# Altium schematic sheet SensorSheet.SchDoc
size A; SheetNumber: 3; SheetTotal: 4
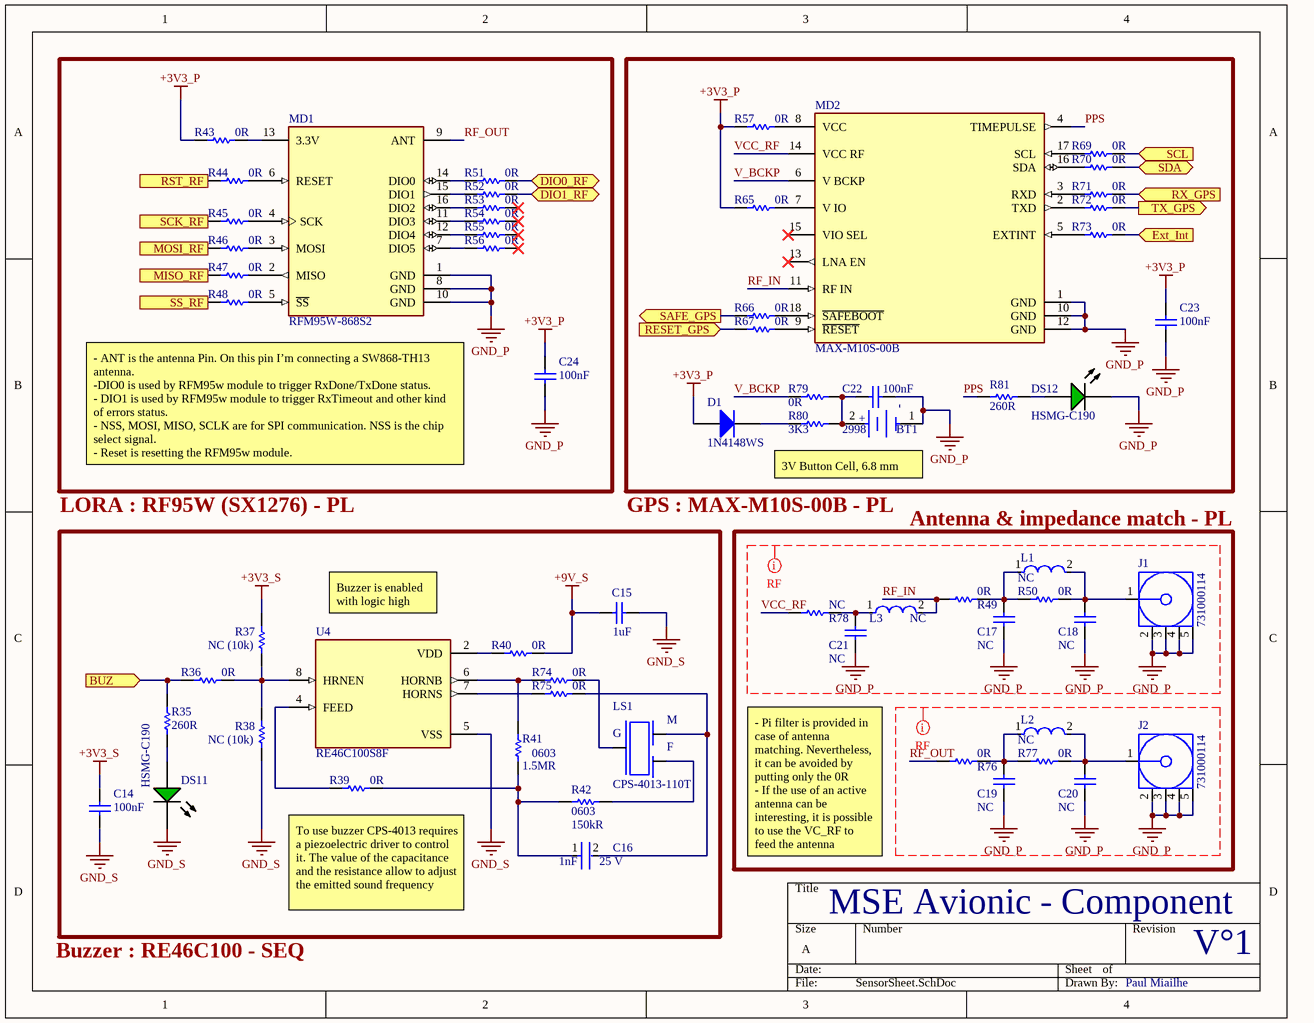
[diagram p0: SensorSheet.SchDoc]

## Parts
BT1  2998  [FP-2998-MFG]
C14  Capacitance: 100nF  [CAPC2013X135X45ML10T25]  (hidden comment: GRM21BR71H104KA01L)
C15  Capacitance: 1uF  [CAPC1608X90X35LL10T15]  (hidden comment: GRM188R61E105KA12D)
C16  Capacitance: 1nF  Voltage Rating: 25 V  [FP-C0603C-CF-MFG]  (hidden comment: C0603C102J3GACTU)
C17  Capacitance: NC  [CAPC2013X135X45ML10T25]  (hidden comment: GRM21BR71H104KA01L)
C18  Capacitance: NC  [CAPC2013X135X45ML10T25]  (hidden comment: GRM21BR71H104KA01L)
C19  Capacitance: NC  [CAPC2013X135X45ML10T25]  (hidden comment: GRM21BR71H104KA01L)
C20  Capacitance: NC  [CAPC2013X135X45ML10T25]  (hidden comment: GRM21BR71H104KA01L)
C21  Capacitance: NC  [CAPC2013X135X45ML10T25]  (hidden comment: GRM21BR71H104KA01L)
C22  Capacitance: 100nF  [CAPC2013X135X45ML10T25]  (hidden comment: GRM21BR71H104KA01L)
C23  Capacitance: 100nF  [CAPC2013X135X45ML10T25]  (hidden comment: GRM21BR71H104KA01L)
C24  Capacitance: 100nF  [CAPC2013X135X45ML10T25]  (hidden comment: GRM21BR71H104KA01L)
D1  1N4148WS  [FAIR-SOD-323_V]
DS11  HSMG-C190  [AVAG-HSMX-C190_V]
DS12  HSMG-C190  [AVAG-HSMX-C190_V]
J1  731000114  [MOLX-731000114_V]
J2  731000114  [MOLX-731000114_V]
L1  NC  [FP-B82422A-MFG]
L2  NC  [FP-B82422A-MFG]
L3  NC  [FP-B82422A-MFG]
LS1  CPS-4013-110T  [XDCR_CPS-4013-110T]
MD1  RFM95W-868S2  [FP-RFM95W-868S2-MFG]
MD2  MAX-M10S-00B  [FP-MAX-M10S-00B-MFG]
R35  260R  [RESC1609X50X30NL8T20]  (no BOM)
R36  0R  [RESC1608X55X25ML10T15]
R37  Resistance: NC (10k)  [RESC1609X55X30LL15T15]  (hidden comment: ERJ3EKF1002V)
R38  Resistance: NC (10k)  [RESC1609X55X30LL15T15]  (hidden comment: ERJ3EKF1002V)
R39  Resistance: 0R  [RESC1608X55X25ML10T15]  (hidden comment: RC0603JR-070RL)
R40  0R  [RESC1608X55X25ML10T15]
R41  Case Code (Imperial): 0603  Resistance: 1.5MR  [RESC1608X55X30ML15T15]  (hidden comment: ERJ-3GEYJ155V)
R42  Case Code (Imperial): 0603  Resistance: 150kR  [RESC1608X55X30NL15T15]  (hidden comment: ERJ-3EKF1503V)
R43  0R  [RESC1608X55X25ML10T15]
R44  0R  [RESC1608X55X25ML10T15]
R45  0R  [RESC1608X55X25ML10T15]
R46  0R  [RESC1608X55X25ML10T15]
R47  0R  [RESC1608X55X25ML10T15]
R48  0R  [RESC1608X55X25ML10T15]
R49  0R  [RESC1608X55X25ML10T15]
R50  0R  [RESC1608X55X25ML10T15]
R51  0R  [RESC1608X55X25ML10T15]
R52  0R  [RESC1608X55X25ML10T15]
R53  0R  [RESC1608X55X25ML10T15]
R54  0R  [RESC1608X55X25ML10T15]
R55  0R  [RESC1608X55X25ML10T15]
R56  0R  [RESC1608X55X25ML10T15]
R57  0R  [RESC1608X55X25ML10T15]
R65  0R  [RESC1608X55X25ML10T15]
R66  0R  [RESC1608X55X25ML10T15]
R67  0R  [RESC1608X55X25ML10T15]
R69  0R  [RESC1608X55X25ML10T15]
R70  0R  [RESC1608X55X25ML10T15]
R71  0R  [RESC1608X55X25ML10T15]
R72  0R  [RESC1608X55X25ML10T15]
R73  0R  [RESC1608X55X25ML10T15]
R74  0R  [RESC1608X55X25ML10T15]
R75  0R  [RESC1608X55X25ML10T15]
R76  0R  [RESC1608X55X25ML10T15]
R77  0R  [RESC1608X55X25ML10T15]
R78  NC  [RESC1608X55X25ML10T15]
R79  0R  [RESC1608X55X25ML10T15]
R80  Resistance: 3K3  [RESC1608X55X25ML10T15]  (hidden comment: RC0603FR-073K3L)
R81  260R  [RESC1609X50X30NL8T20]  (no BOM)
U4  RE46C100S8F  [SOIC127P600X175-8N]

## Blocks framed on the sheet
Antenna & impedance match - PL: C17-C21 J1 J2 L1-L3 R49 R50 R76-R78

## Ports
BUZ (in), DIO0_RF (bidir), DIO1_RF (bidir), Ext_Int (in), MISO_RF (out), MOSI_RF (in), RESET_GPS (in), RST_RF (in), RX_GPS (in), SAFE_GPS (out), SCK_RF (in), SCL (in), SDA (bidir), SS_RF (in), TX_GPS (out)

## Nets
+3V3_P: C23.2 C24.2 D1.1(A) R43.1 R57.1 R65.1
+3V3_S: C14.2 R37.2
+9V_S: C15.1 R40.2
GND_P: BT1.1(C) C17.1 C18.1 C19.1 C20.1 C21.1 C22.1 C23.1 C24.1 DS12.2(K) J1.2 J1.3 J1.4 J1.5 J2.2 J2.3 J2.4 J2.5 MD1.1(GND) MD1.8(GND) MD1.10(GND) MD2.1(GND) MD2.10(GND) MD2.12(GND)
GND_S: C14.1 C15.2 DS11.2(K) R38.1 U4.5(VSS)
BUZ: R35.1 R36.1 ; port BUZ
DIO0_RF: R51.2 ; port DIO0_RF
DIO1_RF: R52.2 ; port DIO1_RF
Ext_Int: R73.2 ; port Ext_Int
MISO_RF: R47.1 ; port MISO_RF
MOSI_RF: R46.1 ; port MOSI_RF
PPS: MD2.4(TIMEPULSE) R81.1
RESET_GPS: R67.1 ; port RESET_GPS
RF_IN: L3.2 MD2.11(RF_IN) R49.1
RF_OUT: MD1.9(ANT) R76.1
RST_RF: R44.1 ; port RST_RF
RX_GPS: R71.2 ; port RX_GPS
SAFE_GPS: R66.1 ; port SAFE_GPS
SCK_RF: R45.1 ; port SCK_RF
SCL: R69.2 ; port SCL
SDA: R70.2 ; port SDA
SS_RF: R48.1 ; port SS_RF
TX_GPS: R72.2 ; port TX_GPS
V_BCKP: MD2.6(V_BCKP) R79.1
VCC_RF: MD2.14(VCC_RF) R78.1
NetBT1_2: BT1.2(A) C22.2 R79.2 R80.1
NetC16_1: C16.1 R39.2 R41.1 R42.1
NetC16_2: C16.2 LS1.1(M) R75.2
NetC17_2: C17.2 L1.1 R49.2 R50.1
NetC18_2: C18.2 J1.1 L1.2 R50.2
NetC19_2: C19.2 L2.1 R76.2 R77.1
NetC20_2: C20.2 J2.1 L2.2 R77.2
NetC21_2: C21.2 L3.1 R78.2
NetD1_2: D1.2(K) R80.2
NetDS11_1: DS11.1(A) R35.2
NetDS12_1: DS12.1(A) R81.2
NetLS1_2: LS1.2(F) R42.2
NetLS1_3: LS1.3(G) R74.1
NetMD1_2: MD1.2(MISO) R47.2
NetMD1_3: MD1.3(MOSI) R46.2
NetMD1_4: MD1.4(SCK) R45.2
NetMD1_5: MD1.5(~{SS}) R48.2
NetMD1_6: MD1.6(RESET) R44.2
NetMD1_7: MD1.7(DIO5) R56.1
NetMD1_11: MD1.11(DIO3) R54.1
NetMD1_12: MD1.12(DIO4) R55.1
NetMD1_13: MD1.13(3.3V) R43.2
NetMD1_14: MD1.14(DIO0) R51.1
NetMD1_15: MD1.15(DIO1) R52.1
NetMD1_16: MD1.16(DIO2) R53.1
NetMD2_2: MD2.2(TXD) R72.1
NetMD2_3: MD2.3(RXD) R71.1
NetMD2_5: MD2.5(EXTINT) R73.1
NetMD2_7: MD2.7(V_IO) R65.2
NetMD2_8: MD2.8(VCC) R57.2
NetMD2_9: MD2.9(~{RESET}) R67.2
NetMD2_16: MD2.16(SDA) R70.1
NetMD2_17: MD2.17(SCL) R69.1
NetMD2_18: MD2.18(~{SAFEBOOT}) R66.2
NetR36_2: R36.2 R37.1 R38.2 U4.8(HRNEN)
NetR39_1: R39.1 U4.4(FEED)
NetR40_1: R40.1 U4.2(VDD)
NetR41_2: R41.2 R74.2 U4.6(HORNB)
NetR75_1: R75.1 U4.7(HORNS)

Not connected (* = marked no-connect by the designer): MD2 13(LNA_EN)* 15(VIO_SEL)*; R53 2*; R54 2*; R55 2*; R56 2*

## Layout directives
net class 50R; rule Width Constraint [Pref Impedance = 50,00ohms    Min Impedance = 50,00ohms    Max Impedance = 50,00ohms]: GND_P, RF_IN, RF_OUT, VCC_RF

## Notes on the sheet
- - ANT is the antenna Pin. On this pin I’m connecting a SW868-TH13 antenna.
  -DIO0 is used by RFM95w module to trigger RxDone/TxDone status.
  - DIO1 is used by RFM95w module to trigger RxTimeout and other kind of errors status.
  - NSS, MOSI, MISO, SCLK are for SPI communication. NSS is the chip select signal.
  - Reset is resetting the RFM95w module.
- LORA : RF95W (SX1276) - PL
- GPS : MAX-M10S-00B - PL
- 3V Button Cell, 6.8 mm
- (near U4) Buzzer is enabled with logic high
- (near R39) To use buzzer CPS-4013 requires a piezoelectric driver to control it. The value of the capacitance and the resistance allow to adjust the emitted sound frequency
- - Pi filter is provided in case of antenna matching. Nevertheless, it can be avoided by putting only the 0R
  - If the use of an active antenna can be interesting, it is possible to use the VC_RF to feed the antenna
- Buzzer : RE46C100 - SEQ
- MSE Avionic - Component
- V°1
- Paul Miailhe
- (in symbol CMP-19636-000010-1) -; +

## Library data of the parts
BT1 = CMP-19636-000010-1: BATTERY RETAINER COIN 6.8MM SMD; Number of Batteries: 1; Package Quantity: 100; Mount: Surface Mount; Case/Package: SMD/SMT; Number of Cells: 1; REACH SVHC: No SVHC; Height: 2.9mm; Contact Material: Bronze; Material: Bronze; Lead Free: Lead Free; Termination: SMD/SMT; Color: Silver
C14 C17-C24 = CMP-2100-03644-1: Chip Capacitor, 0.1 uF, +/- 10%, 50 V, -55 to 125 degC, 0805 (2012 Metric), RoHS, Tape and Reel; Manufacturer: Murata; Voltage: 50V; Insulation Resistance: 10GR; Dielectric Material: Ceramic; Dielectric: X7R; Package Description: 2-Pin Surface Mount Device, Body 2 x 1.25 mm; Manufacturer URL: http://www.murata.com/; Case Code (Imperial): 0805; Datasheet URL: http://psearch.en.murata.com/capacitor/product/GRM21BR71H104KA01%23.pdf; Termination: SMD/SMT; Lead Free: LeadFree; Package Quantity: 1; Mount: SurfaceMount; REACH SVHC: Unknown; Thickness: 0.053inch; Height: 1.25mm; Case/Package: 0805; Voltage Rating: 50V; Width: 0.049inch; Case Code (Metric): 2012; Material: Ceramic; Min Operating Temperature: -55degC; RoHSCompliant: true; Datasheet Version: 42675.0; Voltage Rating (DC): 50V; Tolerance: 10%; Package Reference: 0805; Depth: 1.25mm; Length: 2mm; Max Operating Temperature: 125degC; Packaging: TapeandReel; Number of Pins: 2; Radiation Hardening: No
C15 = CMP-2006-02459-1: Manufacturer: Murata; Material: Ceramic; Tolerance: 10%; Voltage Rating: 25V; Dielectric: X5R; Part Number: GRM188R61E105KA12D; Supplier 1: Farnell; Supplier Part Number 1: 1828802; Manufacturer Part Number: GRM188R61E105KA12D; RoHS: Yes; Category: Ceramic Capacitors; Pricing 1: 10=0.13400, 100=0.05920, 500=0.03800, 1000=0.03090 (GBP); Mount: Surface Mount; Case/Package: 0603; Number of Pins: 2; Case Code (Metric): 1608; Case Code (Imperial): 0603; Min Operating Temperature: -55°C; Max Operating Temperature: 85°C; Packaging: Tape and Reel; Package Quantity: 4000; Voltage Rating (DC): 25V; Termination: SMD/SMT; Voltage: 25V; Length: 1.6mm; Width: 0.031inch; Height: 0.8mm; Depth: 0.8mm; Thickness: 0.035inch; Radiation Hardening: No; RoHS Compliant: Yes; REACH SVHC: No SVHC; Lead Free: Lead Free
C16 = CMP-2006-03010-2: CAP CER 1000PF 25V 5% NP0 0603; Manufacturer: KEMET; Value: 1,000 pF; Tolerance: 0.05; Temperature Characteristic: C0G; Temperature Coefficient: 30ppm/°C; Automotive Grade: Grade 1; Material: Ceramic; Category: Cap; Device Class L2: Capacitors; Octopart: https://octopart.com/c0603c102j3gactu-kemet-8375722; ComponentLink2URL: https://api.kemet.com/component-edge/download/datasheet/C0603C100J5GACAUTO.pdf; Digikey Description: CAP CER 1000PF 25V 5% NP0 0603; Device Class L3: Ceramic Capacitors; Temperature Range Low: -55°C; Automotive: Yes; RoHS: TRUE; Temperature Range High: +125°C; ComponentLink2Description: Datasheet; Mouser Description: Multilayer Ceramic Capacitors MLCC - SMD/SMT 25volts 1000pF C0G 5%; Lead Free: Yes; Height: 0.87mm; Temperature: -55°C to +125°C; Manufacturer Part Number: C0603C102J3GACTU; Device Class L1: Passive Components; Package: C0603C-CF; Supplier 1: Mouser; Supplier Part Number 1: 80-C0603C102J3G; Stock 1: 70048; Pricing 1: 1=0,10000, 10=0,02700, 50=0,02700, 100=0,02200, 500=0,01600, 1000=0,01200, 4000=0,01000, 8000=0,00900, 10000=0,00900 (USD); Mount: Surface Mount; Case/Package: 0603; Number of Pins: 2; Case Code (Imperial): 0603; Case Code (Metric): 1608; Dielectric Material: Ceramic; Contact Plating: Tin,Matte; Min Operating Temperature: -55°C; Max Operating Temperature: 125°C; Packaging: Tape and Reel; Package Quantity: 1; Voltage Rating (DC): 25V; Dielectric: C0G; Termination: SMD/SMT; Series: C; Construction: Flat; Voltage: 25V; Length: 1.6mm; Width: 0.031inch; Thickness: 0.034inch; Depth: 0.8mm; Lead Pitch: 0.7mm; Radiation Hardening: No; RoHS Compliant: Yes; REACH SVHC: No SVHC; ComponentLink1URL: https://datasheet.ciiva.com/18192/getdatasheetpartid-127803-18192629.pdf?src-supplier=Verical; ComponentLink1Description: https://datasheet.ciiva.com/18192/getdatasheetpartid-127803-18192629.pdf?src-supplier=Verical; ComponentLink3URL: https://datasheet.ciiva.com/7823/f9080b-0402-series-c0g-7823966.pdf?src-supplier=Element14; ComponentLink3Description: https://datasheet.ciiva.com/7823/f9080b-0402-series-c0g-7823966.pdf?src-supplier=Element14; ComponentLink4URL: https://datasheet.ciiva.com/7823/f9080b-0402-series-c0g-7823967.pdf?src-supplier=Element14; ComponentLink4Description: https://datasheet.ciiva.com/7823/f9080b-0402-series-c0g-7823967.pdf?src-supplier=Element14
D1 = CMP-004-00001-2: Small Signal Diode, 75 V, 0.15 A, -55 to 150 degC, 2-Pin SOD-323, RoHS, Tape and Reel; Manufacturer: Fairchild; Recovery Time: 4ns; Forward Voltage: 1V; Peak Reverse Current: 5uA; Forward Current: 150mA; Capacitance: -323f; Datasheet URL: https://www.fairchildsemi.com/datasheets/1N/1N4148WS.pdf; Package Reference: SOD-323; Package Description: 2-Pin Small Outline Diode Flat Lead, Body 1.7 x 1.25 mm; Case/Package: SOD-323; Mounting Technology: SM; Manufacturer URL: https://www.fairchildsemi.com/; Pins: 2; Packaging: TapeandReel; Package Quantity: 3000; Min Operating Temperature: -55°C; RoHS Compliant: True; Max Operating Temperature: 150°C; Datasheet Version: Rev. 1.2, 03/2015
DS11 DS12 = CMP-1744-00002-1: Chip LED, Green, 2.2 V, -40 to 85 degC, 2-Pin SMD, RoHS, Tape and Reel; Frequency: 400 KHz; Max Supply Voltage: 5.5 V; Access Time: 3500 ns; Clock Frequency: 100 KHz; Case\Package: SOIC; Density: 32 kb; Nominal Supply Current: 2 mA; Interface: Serial; Min Supply Voltage: 1.7 V; Packaging: Tape and Reel; PackageReference: HSMX-C190; ComponentLink2URL: http://docs.avagotech.com/docs/AV02-0551EN; RoHSCompliant: true; Pins: 8; REACH SVHC: No SVHC; Max Operating Temperature: 85 degC; Width: 4 mm; Radiation Hardening: No; Package Quantity: 3000; ComponentLink3Description: Package Specification; ComponentLink1Description: Manufacturer URL; Min Operating Temperature: -40 degC; PackageDescription: 2-Pin Surface Mount Device, Body 1.6 x 0.8 mm, Height 0.9 mm; Max Clock Frequency: 100 KHz; Height: 1.5 mm; ComponentLink1URL: http://www.avagotech.com/; DatasheetVersion: Mar-12; ComponentLink2Description: Datasheet; Mount: Surface Mount; Length: 5 mm; ComponentLink3URL: http://www.fairchildsemi.com/dwg/MA/MA03D.pdf
J1 J2 = CMP-2000-05487-1: SMA Right-Angle PCB Jack Receptacle, Brass Body, Gold Plated, 50 Ohm, 5-Pin THD, RoHS, Tray; Manufacturer: Molex; Datasheet Version: 09/2016; Package Description: 5-Pin Through Hole Device, Body 14.8 x 6.35 mm, Pitch 2.54 mm; Datasheet URL: http://www.molex.com/webdocs/datasheets/pdf/en-us/0731000114_RF_COAX_CONNECTORS.pdf; Manufacturer URL: http://www.molex.com/; Package Reference: 731000114; Mounting Technology: ThroughHole; Package URL: http://www.molex.com/pdm_docs/sd/731000114_sd.pdf
L1-L3 = CMP-2000-05912-2: FIXED IND 10UH 180MA 1.6 OHM SMD; Tolerance: 10%; Core Material: Ferrite; Q Factor: 27; Self Resonant Frequency: 25MHz; Shielding: Unshielded; Test Frequency: 1MHz; Series Resistance: 1.6R; Radiation Hardening: No; REACH SVHC: No SVHC; Width: 0.098inch; RoHS Compliant: Yes; Case/Package: 1210; DC Current: 180mA; Package Quantity: 2000; Height - Seated (Max): 0.083inch; Rated Current-Max: 180mA; Series: SIMID; Mount: Surface Mount; Depth: 2.8mm; Resistor Type: Wirewound; Max DC Current: 180mA; Termination: SMD/SMT; Contact Plating: Tin; Height: 2.1mm; Inductance: 10uH; Case Code (Metric): 3225; Lead Free: Lead Free; Weight: 0.001764oz; Max Operating Temperature: 125°C; Length: 3.5mm; Packaging: Tape and Reel; Case Code (Imperial): 1210; Inductance Tolerance: 10%; Ratings: AEC-Q200; Number of Pins: 2; Current Rating: 180mA; Military Standard: Not; DC Resistance (DCR): 1.6R
LS1 = CMP-003-000000-2: 40 mm, 9 Vdc, 110 dB, Through Hole, Piezo Audio Transducer Buzzer; MF: CUI Devices; Component Type: Standard; Design Item ID: CPS-4013-110T; Package: None; CUI_purchase_URL: https://www.cuidevices.com/product/audio/buzzers/audio-transducers/cps-4013-110t?utm_source=snapeda.com&utm_medium=referral&utm_campaign=snapedaBOM; Availability: In Stock; Value: *; Source: CPS-4013-110T.SchLib; Check_prices: https://www.snapeda.com/parts/CPS-4013-110T/CUI+Devices/view-part/?ref=eda; MP: CPS-4013-110T; Purchase-URL: https://pricing.snapeda.com/search/part/CPS-4013-110T/?ref=eda; Pin Count: 3; Price: None; SnapEDA_Link: https://www.snapeda.com/parts/CPS-4013-110T/CUI+Devices/view-part/?ref=snap
MD1 = CMP-204316-000001-1: RX TXRX MODULE ISM < 1GHZ SMD; Data Rate: 300Kbps; Frequency: 868MHz; Sensitivity: -123dBm; Interface: SPI; Current - Transmitting: 120mA; Current - Receiving: 12.1mA; Max Operating Temperature: 70°C; Case/Package: SMD/SMT; Packaging: Bulk; Mount: Surface Mount; Min Operating Temperature: -20°C
MD2 = CMP-207130-000026-1: GNSS LCC RX, ROM, TCXO, LNA, SAW
R35 R81 = CMP-2000-03816-5: Manufacturer: Vishay Semiconductor; Voltage Rating: 75 V; Package Quantity: 5000; DatasheetVersion: 06/2012; Min Operating Temperature: -55 degC; ComponentLink1URL: http://www.vishay.com/; Mounting Technology: Surface Mount; Height: 0.45 mm; ComponentLink1Description: Manufacturer URL; REACH SVHC: Unknown; PackageReference: 0603; Packaging: Tape and Reel; Max Operating Temperature: 155 degC; Mount: Surface Mount; ComponentLink2Description: Datasheet; PackageDescription: 2-Pin Surface Mount Device, Body 1.575 x 0.85 mm; Length: 1.55 mm; ComponentLink2URL: http://www.vishay.com/docs/20035/dcrcwe3.pdf; Pins: 2; RoHSCompliant: true
R36 R40 R43-R57 R65-R67 R69-R79 = CMP-2100-03667-1: Chip Resistor, 0 Ohm, +/- 5%, 0.1 W, -55 to 155 degC, 0603 (1608 Metric), RoHS, Tape and Reel; Manufacturer: Yageo; Temperature Coefficient: 200ppm/degreesC; Voltage Rating: 50V; Power Rating: 100mW; Resistance: 0mOhm; Width: 0.8mm; Max Operating Temperature: 155degC; Tolerance: 5%; Package Reference: 0603; Height: 0.45mm; Depth: 0.8mm; Package Description: 2-Pin Surface Mount Device, Body 1.6 x 0.8 mm; Termination: SMD/SMT; Package Quantity: 5000; Case/Package: 0603; Case Code (Imperial): 0603; Radiation Hardening: No; Number of Pins: 2; Length: 1.6mm; Lead Free: LeadFree; Voltage Rating (DC): 50V; Military Standard: Not; Datasheet URL: http://www.yageo.com/NewPortal/yageodocoutput?fileName=/pdf/R-Chip/PYu-RC_Group_51_RoHS_L_5.pdf; Manufacturer URL: http://www.yageo.com/; Packaging: TapeandReel; Case Code (Metric): 1608; Min Operating Temperature: -55degC; Composition: ThickFilm; RoHSCompliant: true; Contact Plating: Tin; Datasheet Version: Rev. 5, 10/2016; REACH SVHC: NoSVHC
R37 R38 = CMP-1012-00623-3: Chip Resistor, 10 KOhm, +/- 1%, 0.1 W, -55 to 155 degC, 0603 (1608 Metric), RoHS, Tape and Reel; Manufacturer: Panasonic; Manufacturer Part Number: ERJ-3EKF1002V; Voltage Rating: 75V; Case\/Package: 0603; Power Rating: 100mW; Temperature Coefficient: 100ppm\/degreesC; Number of Pins: 2; Package Reference: 603; Depth: 0.8mm; Mount: SurfaceMount; Package Description: 2-Pin Surface Mount Device, Body 1.6 x 0.85 mm; Datasheet Version: 02/2017; Length: 1.6mm; Lead Free: LeadFree; Height: 0.45mm; Number of Terminations: 2; Max Power Dissipation: 100mW; Min Operating Temperature: -55degC; Datasheet URL: https://industrial.panasonic.com/cdbs/www-data/pdf/RDA0000/AOA0000C304.pdf; Termination: SMD/SMT; Case Code (Metric): 1608; Tolerance: 1%; Max Operating Temperature: 155degC; RoHSCompliant: true; Voltage Rating (DC): 75V; Radiation Hardening: No; Packaging: TapeandReel; Composition: ThickFilm; Mounting Technology: SurfaceMount; Manufacturer URL: http://www.panasonic.com/; Width: 0.031inch; REACH SVHC: NoSVHC; Contact Plating: Tin; Military Standard: Not; Package Quantity: 1; Supplier 1: Mouser; Supplier Part Number 1: 667-ERJ-3EKF1002V; RoHS: Yes; Category: Chip SMD Resistors; Stock 1: 20455; Pricing 1: 1=0,10000, 10=0,04000, 50=0,04000, 100=0,01700, 1000=0,00700, 5000=0,00500, 10000=0,00500 (USD); Case/Package: 0603; Size Code: 0603; Resistor Type: Thick Film; Series: ERJ; Resistance Tolerance: 1%; Construction: Rectangular; Features: Automotive AEC-Q200; Technology: THICK FILM; RoHS Compliant: Yes; ComponentLink1URL: https://datasheet.ciiva.com/16511/aoa0000ce2-16511861.pdf?src-supplier=Avnet+Asia; ComponentLink1Description: https://datasheet.ciiva.com/16511/aoa0000ce2-16511861.pdf?src-supplier=Avnet+Asia; ComponentLink2URL: https://datasheet.ciiva.com/46372/1678782-46372725.pdf?src-supplier=Element14; ComponentLink2Description: https://datasheet.ciiva.com/46372/1678782-46372725.pdf?src-supplier=Element14; ComponentLink3URL: https://datasheet.ciiva.com/28514/426256-28514198.pdf?src-supplier=Element14; ComponentLink3Description: https://datasheet.ciiva.com/28514/426256-28514198.pdf?src-supplier=Element14; ComponentLink4URL: https://datasheet.ciiva.com/9194/aoa0000ce2-9194199.pdf?src-supplier=Avnet; ComponentLink4Description: https://datasheet.ciiva.com/9194/aoa0000ce2-9194199.pdf?src-supplier=Avnet; ComponentLink5URL: https://datasheet.ciiva.com/7830/aoa0000ce2-7830729.pdf?src-supplier=Element14; ComponentLink5Description: https://datasheet.ciiva.com/7830/aoa0000ce2-7830729.pdf?src-supplier=Element14; ComponentLink6URL: https://datasheet.ciiva.com/17212/aoa0000ce2-17212105.pdf?src-supplier=Avnet+Europe; ComponentLink6Description: https://datasheet.ciiva.com/17212/aoa0000ce2-17212105.pdf?src-supplier=Avnet+Europe; ComponentLink7URL: https://datasheet.ciiva.com/30208/aoa0000ce2-30208985.pdf?src-supplier=Onlinecomponents.com; ComponentLink7Description: https://datasheet.ciiva.com/30208/aoa0000ce2-30208985.pdf?src-supplier=Onlinecomponents.com; ComponentLink8URL: https://datasheet.ciiva.com/48530/aoa0000ce2-48530988.pdf?src-supplier=Avnet; ComponentLink8Description: https://datasheet.ciiva.com/48530/aoa0000ce2-48530988.pdf?src-supplier=Avnet; ComponentLink9URL: https://datasheet.ciiva.com/24070/aoa0000ce2-24070318.pdf?src-supplier=Mouser; ComponentLink9Description: https://datasheet.ciiva.com/24070/aoa0000ce2-24070318.pdf?src-supplier=Mouser; ComponentLink10URL: https://datasheet.ciiva.com/16759/70260748-16759807.pdf?src-supplier=Allied+Electronics; ComponentLink10Description: https://datasheet.ciiva.com/16759/70260748-16759807.pdf?src-supplier=Allied+Electronics
R39 = CMP-2100-03667-1: Chip Resistor, 0 Ohm, +/- 5%, 0.1 W, -55 to 155 degC, 0603 (1608 Metric), RoHS, Tape and Reel; Manufacturer: Yageo; Temperature Coefficient: 200ppm/degreesC; Voltage Rating: 50V; Power Rating: 100mW; Width: 0.8mm; Max Operating Temperature: 155degC; Tolerance: 5%; Package Reference: 0603; Height: 0.45mm; Depth: 0.8mm; Package Description: 2-Pin Surface Mount Device, Body 1.6 x 0.8 mm; Termination: SMD/SMT; Package Quantity: 5000; Case/Package: 0603; Case Code (Imperial): 0603; Radiation Hardening: No; Number of Pins: 2; Length: 1.6mm; Lead Free: LeadFree; Voltage Rating (DC): 50V; Military Standard: Not; Datasheet URL: http://www.yageo.com/NewPortal/yageodocoutput?fileName=/pdf/R-Chip/PYu-RC_Group_51_RoHS_L_5.pdf; Manufacturer URL: http://www.yageo.com/; Packaging: TapeandReel; Case Code (Metric): 1608; Min Operating Temperature: -55degC; Composition: ThickFilm; RoHSCompliant: true; Contact Plating: Tin; Datasheet Version: Rev. 5, 10/2016; REACH SVHC: NoSVHC
R41 = CMP-2000-00727-1: Manufacturer: Panasonic; Tolerance: 5%; Temperature Coefficient: 150ppm/°C; Max Power Dissipation: 100mW; Voltage Rating (DC): 50V; Voltage Rating: 75V; Part Number: ERJ-3GEYJ155V; Supplier 1: Mouser; Supplier Part Number 1: 667-ERJ-3GEYJ155V; Manufacturer Part Number: ERJ-3GEYJ155V; RoHS: Yes; Category: Chip SMD Resistors; Stock 1: 76730; Pricing 1: 1=0,10000, 10=0,03400, 50=0,03400, 100=0,01400, 1000=0,00700, 2500=0,00600, 5000=0,00400, 10000=0,00400 (USD); Mount: Surface Mount; Case/Package: 0603; Case Code (Metric): 1608; Contact Plating: Tin; Min Operating Temperature: -55°C; Max Operating Temperature: 155°C; Packaging: Tape and Reel; Resistor Type: Thick Film; Package Quantity: 1; Number of Terminations: 2; Features: Automotive AEC-Q200; Series: ERJ; Power Rating: 100mW; Termination: SMD/SMT; Resistance Tolerance: 5%; Construction: Rectangular; Technology: THICK FILM; Length: 1.6mm; Width: 0.031inch; Height: 0.45mm; Depth: 0.8mm; RoHS Compliant: Yes; Lead Free: Lead Free; Military Standard: Not; REACH SVHC: No SVHC; ComponentLink1URL: https://datasheet.ciiva.com/11821/0900766b80f806dd-11821430.pdf?src-supplier=RSComponents; ComponentLink1Description: https://datasheet.ciiva.com/11821/0900766b80f806dd-11821430.pdf?src-supplier=RSComponents; ComponentLink2URL: https://datasheet.ciiva.com/16780/70255313-16780680.pdf?src-supplier=Allied+Electronics; ComponentLink2Description: https://datasheet.ciiva.com/16780/70255313-16780680.pdf?src-supplier=Allied+Electronics; ComponentLink3URL: https://datasheet.ciiva.com/9198/aoa0000ce1-9198090.pdf?src-supplier=Avnet; ComponentLink3Description: https://datasheet.ciiva.com/9198/aoa0000ce1-9198090.pdf?src-supplier=Avnet; ComponentLink4URL: https://datasheet.ciiva.com/30248/4aoa0000ce1-30248779.pdf?src-supplier=Onlinecomponents.com; ComponentLink4Description: https://datasheet.ciiva.com/30248/4aoa0000ce1-30248779.pdf?src-supplier=Onlinecomponents.com; ComponentLink5URL: https://datasheet.ciiva.com/5959/1500035-5959709.pdf?src-supplier=Farnell; ComponentLink5Description: https://datasheet.ciiva.com/5959/1500035-5959709.pdf?src-supplier=Farnell; ComponentLink6URL: https://datasheet.ciiva.com/28658/1678796-28658445.pdf?src-supplier=Element14; ComponentLink6Description: https://datasheet.ciiva.com/28658/1678796-28658445.pdf?src-supplier=Element14; ComponentLink7URL: https://datasheet.ciiva.com/15828/aoa0000ce1-15828430.pdf?src-supplier=Onlinecomponents.com; ComponentLink7Description: https://datasheet.ciiva.com/15828/aoa0000ce1-15828430.pdf?src-supplier=Onlinecomponents.com
R42 = CMP-1012-00754-2: Manufacturer: Panasonic; Power Rating: 100mW; Tolerance: 1%; Voltage Rating: 75V; Temperature Coefficient: 100ppm/°C; Part Number: ERJ-3EKF1503V; Supplier 1: Mouser; Supplier Part Number 1: 667-ERJ-3EKF1503V; Manufacturer Part Number: ERJ-3EKF1503V; RoHS: Yes; Category: Chip SMD Resistors; Stock 1: 1123; Pricing 1: 1=0,10000, 10=0,03700, 50=0,03700, 100=0,01500, 1000=0,00800, 2500=0,00700, 5000=0,00600, 10000=0,00600 (USD); Mount: Surface Mount; Case/Package: 0603; Number of Pins: 2; Case Code (Metric): 1608; Contact Plating: Tin; Weight: 7.1E-05oz; Min Operating Temperature: -55°C; Max Operating Temperature: 155°C; Packaging: Tape and Reel; Package Quantity: 1; Termination: SMD/SMT; Max Power Dissipation: 100mW; Resistor Type: Thick Film; Number of Terminations: 2; Features: Automotive AEC-Q200; Series: ERJ; Resistance Tolerance: 1%; Voltage Rating (DC): 75V; Construction: Rectangular; Length: 1.6mm; Width: 0.8mm; Height: 0.022inch; Depth: 0.8mm; Radiation Hardening: No; Military Standard: Not; Lead Free: Lead Free; RoHS Compliant: Yes; REACH SVHC: No SVHC; ComponentLink1URL: https://datasheet.ciiva.com/6137/aoa0000ce2-6137485.pdf?src-supplier=Farnell; ComponentLink1Description: https://datasheet.ciiva.com/6137/aoa0000ce2-6137485.pdf?src-supplier=Farnell; ComponentLink2URL: https://datasheet.ciiva.com/7909/aoa0000ce2-7909193.pdf?src-supplier=Element14; ComponentLink2Description: https://datasheet.ciiva.com/7909/aoa0000ce2-7909193.pdf?src-supplier=Element14; ComponentLink3URL: https://datasheet.ciiva.com/7909/426256-7909546.pdf?src-supplier=Element14; ComponentLink3Description: https://datasheet.ciiva.com/7909/426256-7909546.pdf?src-supplier=Element14; ComponentLink4URL: https://datasheet.ciiva.com/22687/1678782-22687434.pdf?src-supplier=Element14; ComponentLink4Description: https://datasheet.ciiva.com/22687/1678782-22687434.pdf?src-supplier=Element14; ComponentLink5URL: https://datasheet.ciiva.com/46420/1678782-46420173.pdf?src-supplier=Element14; ComponentLink5Description: https://datasheet.ciiva.com/46420/1678782-46420173.pdf?src-supplier=Element14; ComponentLink6URL: https://datasheet.ciiva.com/16787/70260748-16787015.pdf?src-supplier=Allied+Electronics; ComponentLink6Description: https://datasheet.ciiva.com/16787/70260748-16787015.pdf?src-supplier=Allied+Electronics; ComponentLink7URL: https://datasheet.ciiva.com/9185/aoa0000ce2-9185494.pdf?src-supplier=Avnet; ComponentLink7Description: https://datasheet.ciiva.com/9185/aoa0000ce2-9185494.pdf?src-supplier=Avnet; ComponentLink8URL: https://datasheet.ciiva.com/48530/aoa0000ce2-48530984.pdf?src-supplier=Avnet; ComponentLink8Description: https://datasheet.ciiva.com/48530/aoa0000ce2-48530984.pdf?src-supplier=Avnet; ComponentLink9URL: https://datasheet.ciiva.com/30145/aoa0000ce2-30145242.pdf?src-supplier=Onlinecomponents.com; ComponentLink9Description: https://datasheet.ciiva.com/30145/aoa0000ce2-30145242.pdf?src-supplier=Onlinecomponents.com; ComponentLink10URL: https://datasheet.ciiva.com/17207/aoa0000ce2-17207477.pdf?src-supplier=Avnet+Europe; ComponentLink10Description: https://datasheet.ciiva.com/17207/aoa0000ce2-17207477.pdf?src-supplier=Avnet+Europe
R80 = CMP-1012-00567-2: Chip Resistor, 3.3 KOhm, +/- 1%, 0.1 W, -55 to 155 degC, 0603 (1608 Metric), RoHS, Tape and Reel; Manufacturer: Yageo; Temperature Coefficient: 100ppm/degreesC; Voltage Rating: 50V; Max Power Dissipation: 100mW; Case Code (Metric): 1608; Case/Package: 0603; Composition: ThickFilm; RoHSCompliant: true; Datasheet Version: Rev. 5, 10/2016; REACH SVHC: NoSVHC; Width: 0.8mm; Package Quantity: 1; Depth: 0.8mm; Voltage Rating (DC): 50V; Termination: SMD/SMT; Length: 1.6mm; Lead Free: LeadFree; Package Description: 2-Pin Surface Mount Device, Body 1.6 x 0.8 mm; Max Operating Temperature: 155degC; Tolerance: 1%; Height: 0.45mm; Number of Pins: 2; Military Standard: Not; Power Rating: 100mW; Datasheet URL: http://www.yageo.com/NewPortal/yageodocoutput?fileName=/pdf/R-Chip/PYu-RC_Group_51_RoHS_L_5.pdf; Case Code (Imperial): 0603; Manufacturer URL: http://www.yageo.com/; Packaging: TapeandReel; Min Operating Temperature: -55degC; Package Reference: 0603; Number of Terminations: 2
U4 = CMP-005-000000-2: IC HORN DRIVER DUAL 8SOIC; MF: Microchip Technology; Digi-Key_Purchase_URL: https://www.digikey.ca/product-detail/en/microchip-technology/RE46C100S8F/RE46C100S8F-ND/2137466?utm_source=snapeda&utm_medium=aggregator&utm_campaign=symbol; MP: RE46C100S8F; Package: SOIC-8 Microchip Technology; Component Type: Standard; Pin Count: 6; Digi-Key_Part_Number: RE46C100S8F-ND; Design Item ID: RE46C100S8F; Value: *; SnapEDA_Link: https://www.snapeda.com/parts/RE46C100S8F/Microchip/view-part/3611216/?ref=snap; Source: SnapEDAsch.SchLib